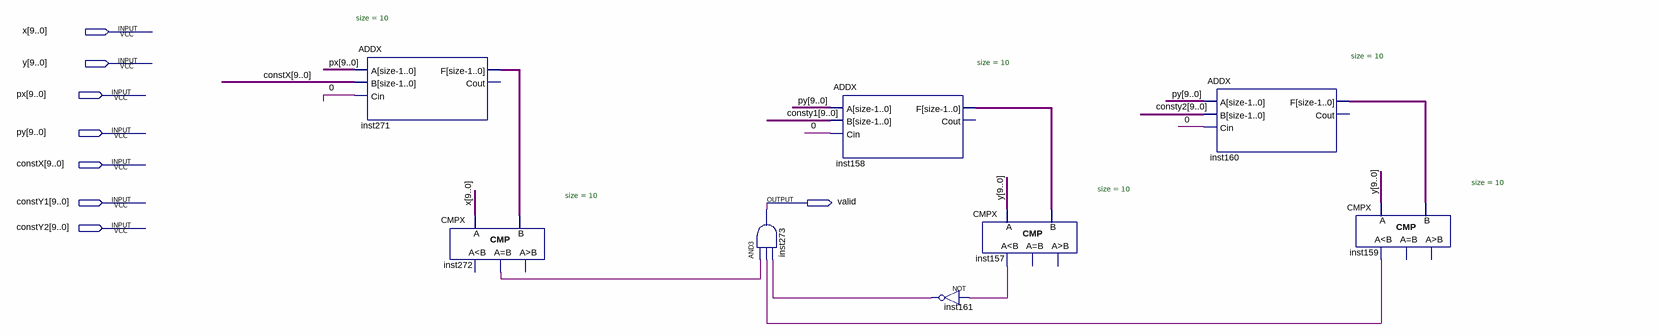
[diagram p0: schematic sheet]
// Quartus schematic duzVertik.bdf as structural Verilog: 8 symbols, 8 pins
module duzVertik (
  input  [9:0] x,
  input  [9:0] y,
  input  [9:0] px,
  input  [9:0] py,
  input  [9:0] constX,
  input  [9:0] constY1,
  input  [9:0] constY2,
  output valid
);

  wire \0 , inst157_ls, inst159_ls, inst161_out, inst272_eq;
  wire [9:0] inst158_f, inst160_f, inst271_f;

  ADDX #(.size(10)) inst271 (.A(px), .B(constX), .Cin(\0 ), .F(inst271_f));  // open: Cout
  CMPX #(.size(10)) inst272 (.A(x), .B(inst271_f), .eq(inst272_eq));  // open: ls, gr
  and inst273 (valid, inst272_eq, inst159_ls, inst161_out);
  ADDX #(.size(10)) inst158 (.A(py), .B(constY1), .Cin(\0 ), .F(inst158_f));  // open: Cout
  not inst161 (inst161_out, inst157_ls);
  CMPX #(.size(10)) inst157 (.A(y), .B(inst158_f), .ls(inst157_ls));  // open: eq, gr
  ADDX #(.size(10)) inst160 (.A(py), .B(constY2), .Cin(\0 ), .F(inst160_f));  // open: Cout
  CMPX #(.size(10)) inst159 (.A(y), .B(inst160_f), .ls(inst159_ls));  // open: eq, gr
endmodule
